# Altium schematic sheet XBEEPROschematic.SchDoc
size A4
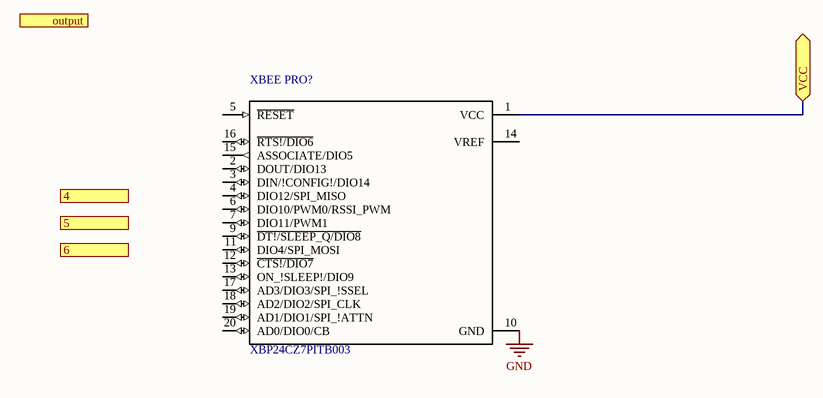
[diagram p0: XBEEPROschematic.SchDoc]

## Parts
XBEE_PRO?  XBP24CZ7PITB003  [DIP2200W51P200L3294H279Q20P]

## Ports
4, 5, 6, output, VCC

## Nets
GND: XBEE_PRO?.10(GND)
VCC: XBEE_PRO?.1(VCC) ; port VCC

Not connected (* = marked no-connect by the designer): XBEE_PRO? 2(DOUT/DIO13) 3(DIN/!CONFIG!/DIO14) 4(DIO12/SPI_MISO) 5(~{RESET}) 6(DIO10/PWM0/RSSI_PWM) 7(DIO11/PWM1) 9(~{D}T~{!/SLEEP}_~{Q/DIO8}) 11(DIO4/SPI_MOSI) 12(~{CTS!/DIO7}) 13(ON_!SLEEP!/DIO9) 14(VREF) 15(ASSOCIATE/DIO5) 16(~{RTS!/DIO6}) 17(AD3/DIO3/SPI_!SSEL) 18(AD2/DIO2/SPI_CLK) 19(AD1/DIO1/SPI_!ATTN) 20(AD0/DIO0/CB)

## Library data of the parts
XBEE_PRO? = XBP24CZ7PITB003: Programmable Xbee-Pro Zb S2c Th %28Pcb Antenna%29; MF: Digi International; Package: Module Digi International; Price: 31.31 USD; MP: XBP24CZ7PITB003; Availability: Bad; Value: *